# EAGLE design Twig - Alcohol Sensor v0.9b (EAGLE 5.10)
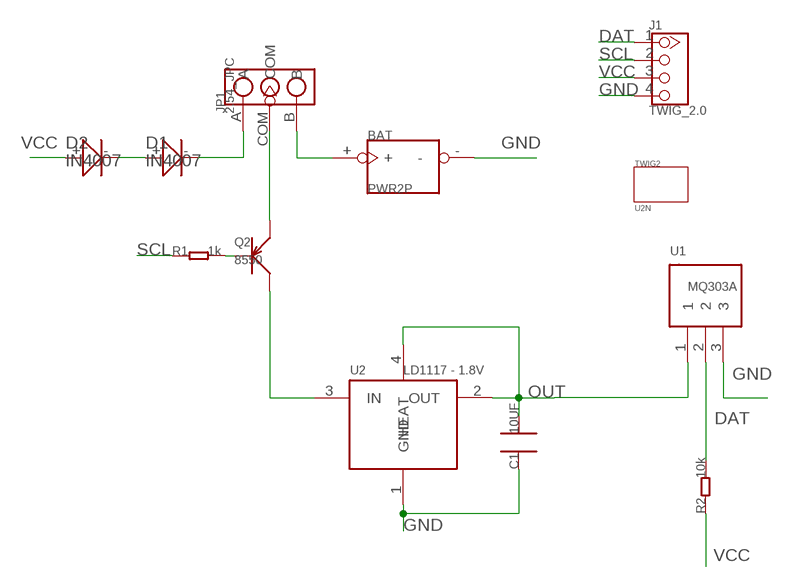
[diagram p0: schematic, sheet 1]

## Parts
BAT  PWR2P  [PWR_JST]
C1  10UF  C0805  [0805]
D1  IN4007  010-D2010  [D2010]
D2  IN4007  010-D2010  [D2010]
J1  TWIG_2.0  [2.0_1X4]
JP1  2.54_JPC  [2.54_JP_C]
Q2  8550  010-PNPSOT23  [SOT23]
R1  1k  005-R0805  [0805]
R2  10k  005-R0805  [0805]
TWIG2  U2N  [U2N]
U1  MQ303A  [MQ303A]
U2  LD1117 - 1.8V  LD1117SOT89  [SOT89]

## Nets
DAT: J1.1 R2.2 U1.2
GND: BAT.- C1.1 J1.4 U1.3 U2.1(GND)
N$1: D1.- JP1.A
N$2: Q2.3(C) U2.3(IN)
N$3: Q2.1(B) R1.2
N$4: JP1.COM Q2.2(E)
N$5: BAT.+ JP1.B
N$7: D1.+ D2.-
OUT: C1.2 U1.1 U2.2(OUT) U2.4(HEAT)
SCL: J1.2 R1.1
VCC: D2.+ J1.3 R2.1

## Library data of the parts
BAT = CONNECTER:PWR2P
C1 = CPT_SMD:C0805
D1 D2 = Discrete:010-D*
J1 = CONNECTER:TWIG_2.0
JP1 = CPT_CJ:2.54_JP
Q2 = Discrete:010-PNP*: PNP audion
R1 R2 = Discrete:005-R*
TWIG2 = twig_template1:U2N
U1 = MQ303A:MQ303A
U2 = ICs_v54:LD1117

## Board
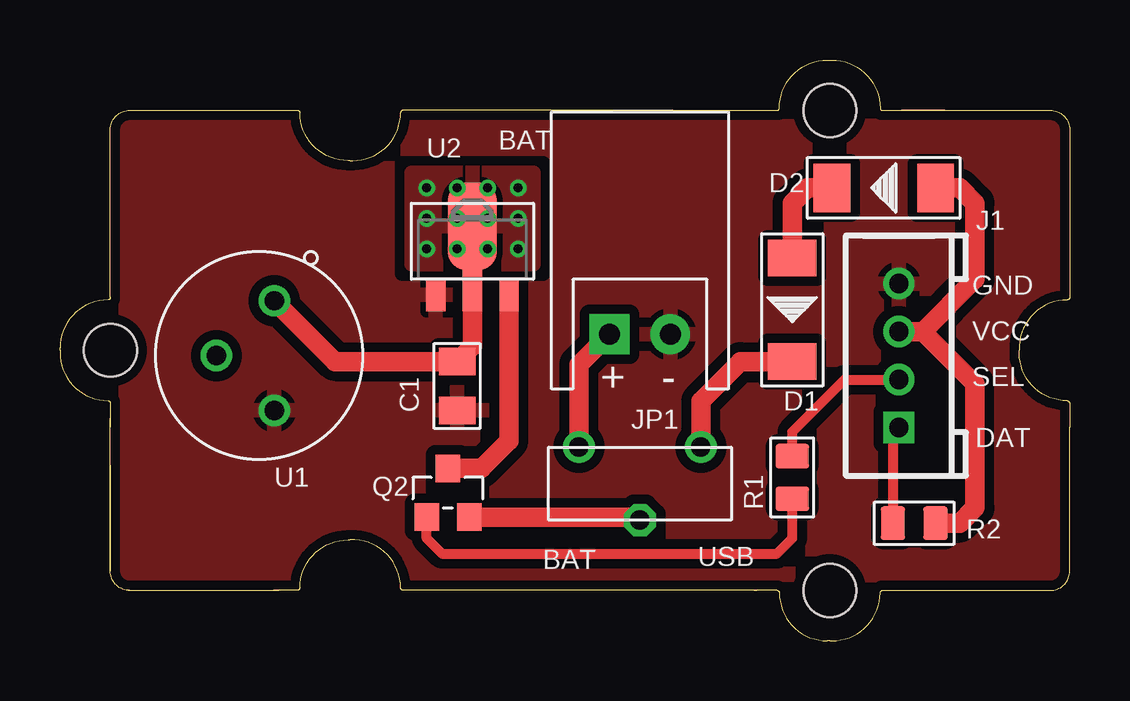
[diagram p1: board, top side]
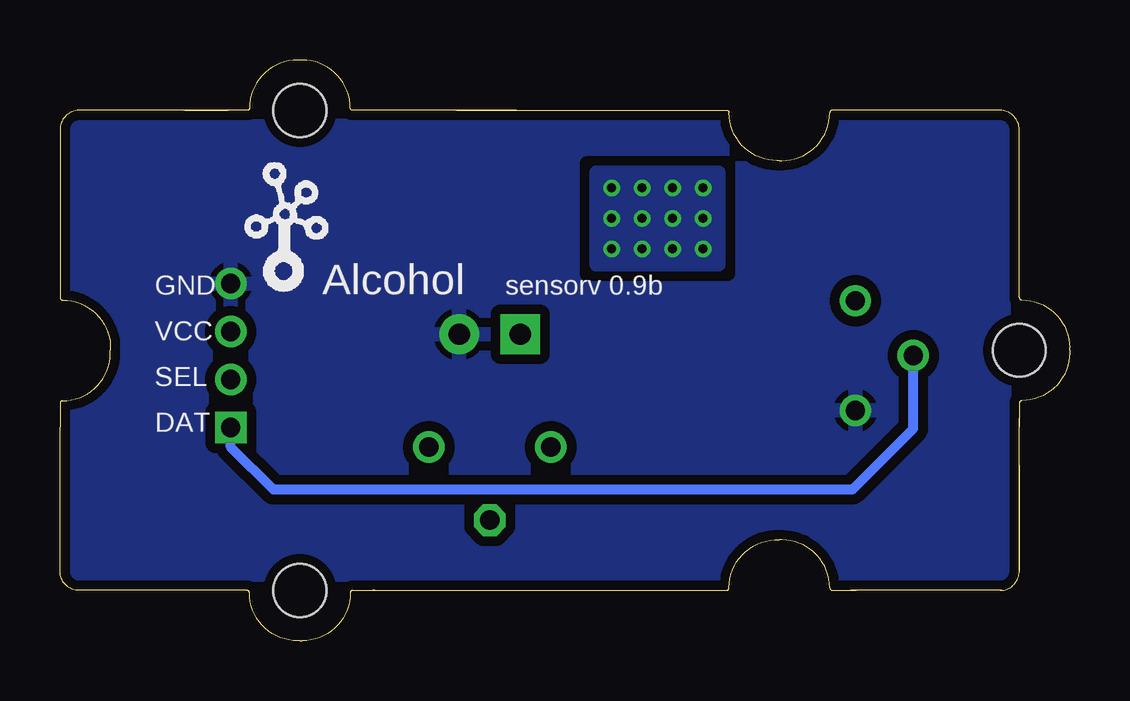
[diagram p2: board, bottom side, seen from below]

Size 42.09 x 24.2 mm. Coordinates in mm from the lower left corner, seen from the top.
Copper layers (1*16): Top 0.035mm / dielectric 1.5mm / Bottom 0.035mm
Design rules "SeeedStudio_rule_no_angle_090911": minimum track width 6mil, minimum drill 12mil, track to track 6mil, track to pad 6mil, pad to pad 6mil, via to via 6mil, smd to smd 0mil, copper to edge 10mil, drill to drill 10mil, minimum pad ring 10mil, minimum via ring 6mil, stop-mask expansion 2mil, vias tented up to drill 100mil, thermal gap 10mil

### Footprints (pad centres in the part's own frame; a part is rotated, then mirrored left to right if it is on the bottom)
PWR_JST = drill 0.889 pad 1.651 square: + 2.286,-1.27 | drill 0.889 pad 1.651 round: - 2.286,1.27
0805 = smd 1.143 x 1.524: 1 -1.016,0; 2 1.016,0
D2010 = smd 1.524 x 2.032: + -2.159,0; - 2.159,0
2.0_1X4 = drill 0.8 pad 1.27 square: 1 -3,0 | drill 0.8 pad 1.27 round: 2 -1,0; 3 1,0; 4 3,0
2.54_JP_C = drill 0.813 round: A -1.27,2.54; B -1.27,-2.54 | drill 0.813 octagon: COM 1.778,0
SOT23 = smd 1.016 x 1.143: 1 -0.889,-1.016; 2 0.889,-1.016; 3 0,1.016
0805' = smd 1.016 x 1.397: 1 -0.889,0; 2 0.889,0
U2N = hole 2.2: 10.453,-10.42; 10.453,9.58; -19.535,-0.415
MQ303A = drill 0.8 round: 1 -2.286,0.635; 2 0,-1.778; 3 2.286,0.635
SOT89 = smd 0.8 x 1.4: 1 -1.524,-1.905; 3 1.524,-1.905 | smd 0.8 x 1.9: 2 0,-1.651 | smd 2.032 x 3.65: 4 0,0.94

### Placement (x,y rotation side)
BAT  24.18,15.06 270 top
C1  16.56,10.61 90 top
D1  30.53,13.79 270 top
D2  34.34,18.87 180 top
J1  34.97,11.88 90 top
JP1  24.18,6.8 270 top
Q2  16.17,6.17 0 top
R1  1k  [0805']  30.53,6.8 270 top
R2  10k  [0805']  35.61,4.9 180 top
TWIG2  21.64,12.52 0 top
U1  8.3,11.88 270 top
U2  17.19,16.33 0 top
U$1  [TWIGLOGO_BOTTOM]  31.8,14.42 0 top

### Tracks (layer width: path | path; a pad name or v marks a point on that pad's centre or on a via)
DAT
  Top 0.406: R2.2 34.72,8.63 J1.1
  Bottom 0.406: U1.2 6.52,8.84 9.06,6.3 33.19,6.3 34.97,8.07 J1.1
GND
  pour Top (isolate 0.406, rank 6): 0.05,25.22 43.23,25.22 43.23,-0.82 0.05,-0.82
  pour Bottom (isolate 0.406, rank 6): 0.05,25.22 43.23,25.22 43.23,-0.82 0.05,-0.82
N$1
  Top 0.813: D1.- 28.37,11.63 26.71,9.98 JP1.A
N$2
  Top 0.813: Q2.3 17.57,7.19 18.71,8.33 U2.3
N$3
  Top 0.406: Q2.1 15.29,4.26 15.92,3.63 29.89,3.63 30.53,4.26 R1.2
N$4
  Top 0.813: Q2.2 24.05,5.15 JP1.COM
N$5
  Top 0.813: JP1.B 21.64,11.5 BAT.+
N$7
  Top 0.813: D2.- 31.16,18.87 30.53,18.23 D1.+
OUT  (via drill 0.38)
  Top 0.813: U2.4 U2.2 17.19,12.27 C1.2 11.48,11.63 U1.1
  other vias: 15.29,16.33 16.56,16.33 17.83,16.33 19.1,16.33 15.29,17.6 16.56,17.6 17.83,17.6 19.1,17.6 15.29,18.87 16.56,18.87 17.83,18.87 19.1,18.87
  pour Top (isolate 0.152): 14.65,19.5 19.73,19.5 19.73,15.69 14.65,15.69
  pour Bottom (isolate 0.152): 14.65,19.5 19.73,19.5 19.73,15.69 14.65,15.69
SCL
  Top 0.406: J1.2 32.7,10.88 30.53,8.71 R1.1
VCC
  Top 0.813: 35.97,12.88 J1.3 | R2.1 37.51,4.9 38.14,5.53 38.14,10.71 35.97,12.88 | D2.+ 37.51,18.87 38.14,18.23 38.14,15.06 35.97,12.88

### Text on the board
tPlace: GND | VCC | + | - | SEL | DAT | BAT | USB
bPlace: sensorv 0.9b | Alcohol | GND | VCC | SEL | DAT